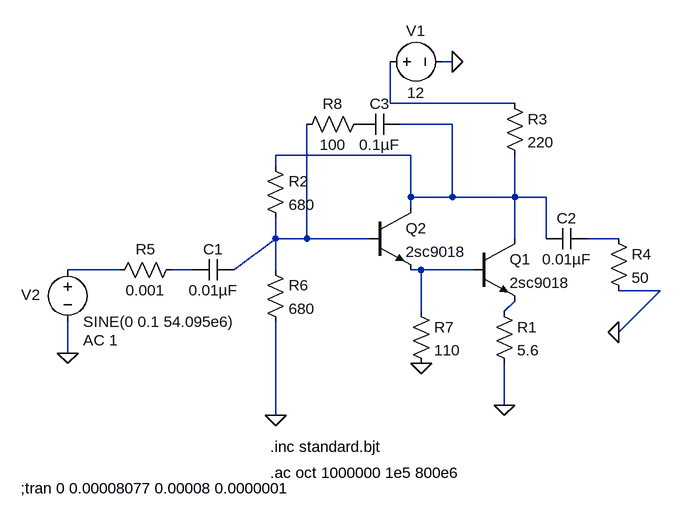
[diagram p0: schematic MMIC-BJT-CE-Feedback.asc]
MMIC-BJT-CE-Feedback.asc, the LTspice schematic file:
Version 4
SHEET 1 880 680
WIRE 288 -176 272 -176
WIRE 192 -112 192 -176
WIRE 384 -112 192 -112
WIRE 288 -80 208 -80
WIRE 224 -32 16 -32
WIRE 16 -16 16 -32
WIRE 224 32 224 -32
WIRE 288 32 288 -80
WIRE 288 32 224 32
WIRE 384 32 384 -32
WIRE 384 32 288 32
WIRE 432 32 384 32
WIRE 224 48 224 32
WIRE 16 96 16 64
WIRE 64 96 64 -80
WIRE 64 96 16 96
WIRE 160 96 64 96
WIRE 384 96 384 32
WIRE 432 96 432 32
WIRE 544 96 496 96
WIRE -224 144 -304 144
WIRE -112 144 -144 144
WIRE -48 144 16 96
WIRE 16 144 16 96
WIRE 240 144 224 144
WIRE 320 144 240 144
WIRE 608 176 544 176
WIRE 240 208 240 144
WIRE 368 208 384 192
WIRE 544 240 608 176
WIRE -304 272 -304 224
WIRE 368 352 368 288
WIRE 16 368 16 224
FLAG 368 352 0
FLAG 288 -176 0
FLAG -304 272 0
FLAG 16 368 0
FLAG 544 240 0
FLAG 240 288 0
SYMBOL res 352 192 R0
SYMATTR InstName R1
SYMATTR Value 5.6
SYMATTR SpiceLine tol=1% pwr=1
SYMBOL npn 320 96 R0
SYMATTR InstName Q1
SYMATTR Value 2sc9018
SYMBOL voltage 176 -176 R270
WINDOW 0 32 56 VTop 2
WINDOW 3 -32 56 VBottom 2
WINDOW 123 0 0 Left 2
WINDOW 39 4 56 VTop 2
SYMATTR InstName V1
SYMATTR Value 12
SYMBOL voltage -304 128 R0
WINDOW 123 24 124 Left 2
WINDOW 39 0 0 Left 2
WINDOW 0 -71 54 Left 2
SYMATTR Value2 AC 1
SYMATTR InstName V2
SYMATTR Value SINE(0 0.1 54.095e6)
SYMBOL res 528 80 R0
SYMATTR InstName R4
SYMATTR Value 50
SYMATTR SpiceLine tol=1% pwr=1
SYMBOL res -240 160 R270
WINDOW 0 32 56 VTop 2
WINDOW 3 0 56 VBottom 2
SYMATTR InstName R5
SYMATTR Value 0.001
SYMATTR SpiceLine tol=1% pwr=1
SYMBOL res 0 128 R0
SYMATTR InstName R6
SYMATTR Value 680
SYMBOL res 0 -32 R0
SYMATTR InstName R2
SYMATTR Value 680
SYMATTR SpiceLine tol=1% pwr=1
SYMBOL cap -48 160 M270
WINDOW 0 32 32 VTop 2
WINDOW 3 0 32 VBottom 2
SYMATTR InstName C1
SYMATTR Value 0.01µF
SYMBOL cap 432 80 M90
WINDOW 0 0 32 VBottom 2
WINDOW 3 32 32 VTop 2
SYMATTR InstName C2
SYMATTR Value 0.01µF
SYMBOL npn 160 48 R0
SYMATTR InstName Q2
SYMATTR Value 2sc9018
SYMBOL res 224 192 R0
SYMATTR InstName R7
SYMATTR Value 110
SYMATTR SpiceLine tol=1% pwr=1
SYMBOL res 48 -64 R270
WINDOW 0 32 56 VTop 2
WINDOW 3 0 56 VBottom 2
SYMATTR InstName R8
SYMATTR Value 100
SYMATTR SpiceLine tol=1% pwr=1
SYMBOL cap 208 -64 M270
WINDOW 0 32 32 VTop 2
WINDOW 3 0 32 VBottom 2
SYMATTR InstName C3
SYMATTR Value 0.1µF
SYMBOL res 368 -128 R0
SYMATTR InstName R3
SYMATTR Value 220
TEXT 8 416 Left 2 !.inc standard.bjt
TEXT 8 456 Left 2 !.ac oct 1000000 1e5 800e6
TEXT -376 480 Left 2 !;tran 0 0.00008077 0.00008 0.0000001

The netlist it stands for:
* MMIC-BJT-CE-Feedback.asc
R1 N008 0 5.6 tol=1% pwr=1
Q1 N002 N007 N008 0 2sc9018
V1 N001 0 12
V2 N005 0 SINE(0 0.1 54.095e6) AC 1
R4 N004 0 50 tol=1% pwr=1
R5 N005 N006 0.001 tol=1% pwr=1
R6 N003 0 680
R2 N002 N003 680 tol=1% pwr=1
C1 N003 N006 0.01µF
C2 N002 N004 0.01µF
Q2 N002 N003 N007 0 2sc9018
R7 N007 0 110 tol=1% pwr=1
R8 N003 P001 100 tol=1% pwr=1
C3 N002 P001 0.1µF
R3 N001 N002 220
.model NPN NPN
.model PNP PNP
.lib standard.bjt
.inc standard.bjt
.ac oct 1000000 1e5 800e6
;tran 0 0.00008077 0.00008 0.0000001
.backanno
.end